# EAGLE design 6WLS-PASSIVE (EAGLE 7.4.0)
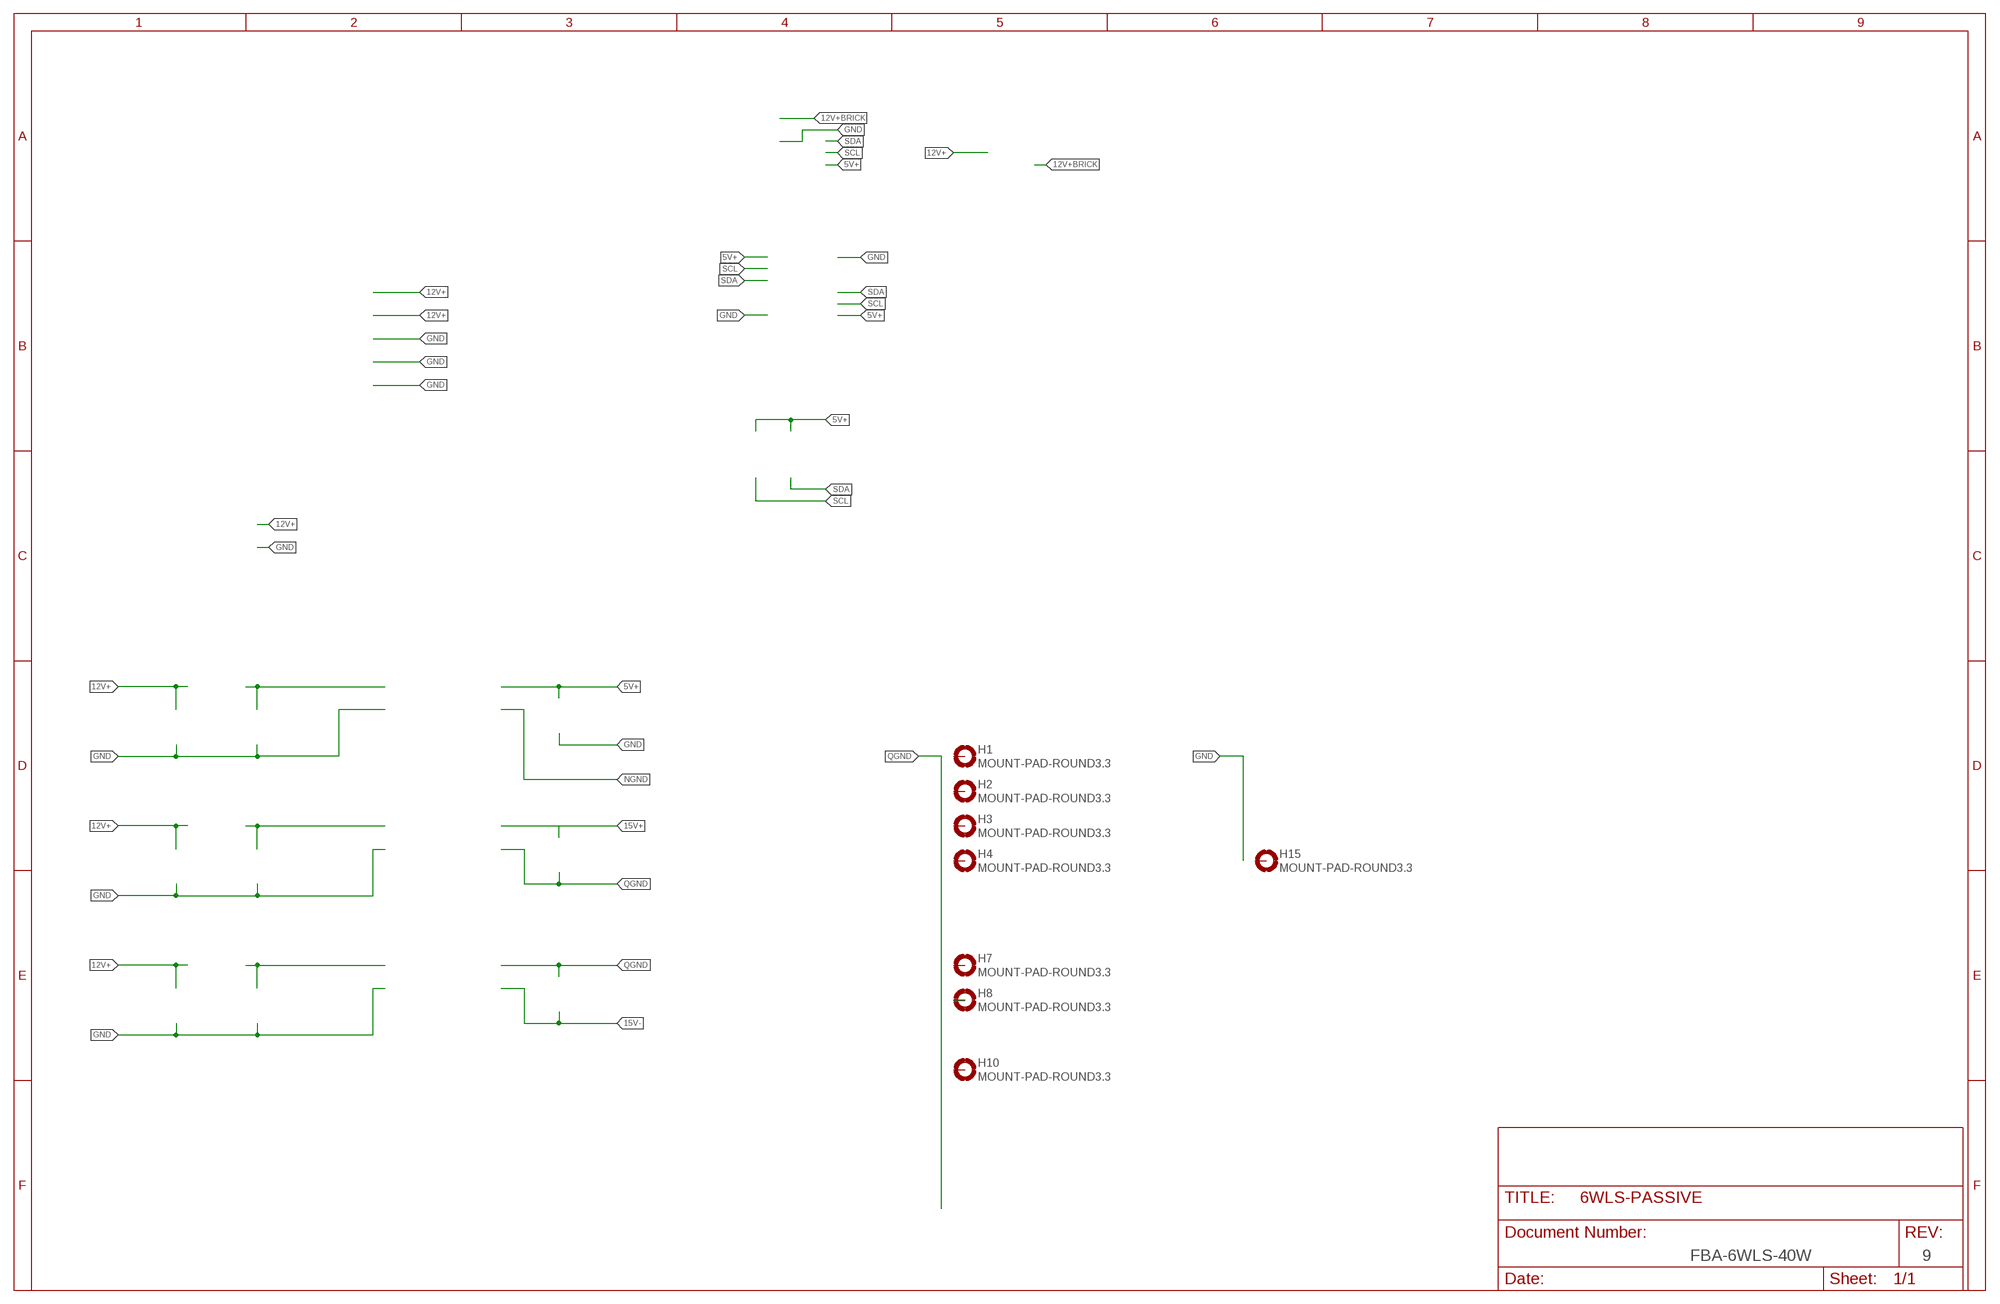
[diagram p0: schematic, sheet 1]

## Parts
H1  MOUNT-PAD-ROUND3.3  [3,3-PAD]
H2  MOUNT-PAD-ROUND3.3  [3,3-PAD]
H3  MOUNT-PAD-ROUND3.3  [3,3-PAD]
H4  MOUNT-PAD-ROUND3.3  [3,3-PAD]
H7  MOUNT-PAD-ROUND3.3  [3,3-PAD]
H8  MOUNT-PAD-ROUND3.3  [3,3-PAD]
H10  MOUNT-PAD-ROUND3.3  [3,3-PAD]
H15  MOUNT-PAD-ROUND3.3  [3,3-PAD]

## Nets
N$5: H8.B3,3(MOUNT)
Unconnected: H1.B3,3(MOUNT) H2.B3,3(MOUNT) H3.B3,3(MOUNT) H4.B3,3(MOUNT) H7.B3,3(MOUNT) H10.B3,3(MOUNT) H15.B3,3(MOUNT)

## Notes on the sheet
- FBA-6WLS-40W | 9

## Library data of the parts
H1-H4 H7 H8 H10 H15 = holes:MOUNT-PAD-ROUND: MOUNTING PAD, round

## Net classes
0 Signal: width 0.254 mm, clearance 0.205 mm
1 Power: width 0.508 mm, clearance 0.205 mm to class 0, clearance 0.205 mm
2 GND: width 0.889 mm

## Board
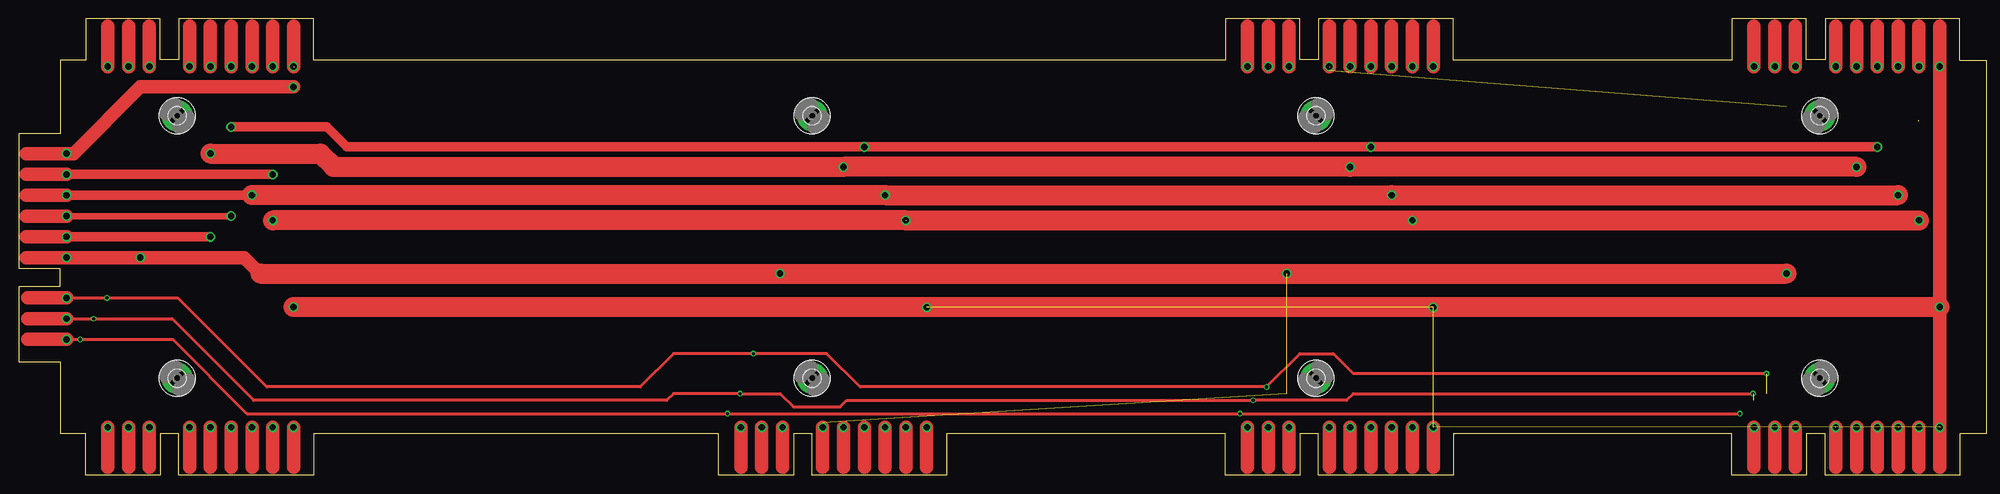
[diagram p1: board, top side]
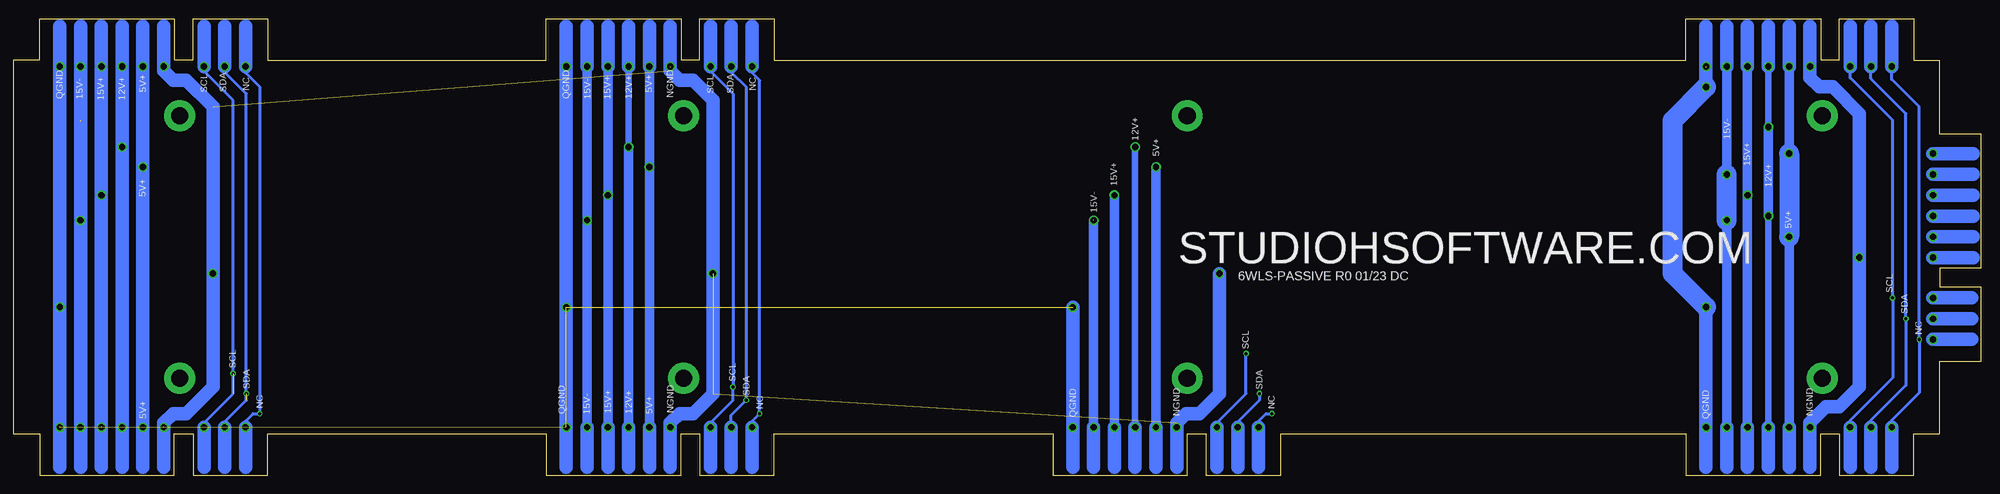
[diagram p2: board, bottom side, seen from below]

Size 374.97 x 87 mm. Coordinates in mm from the lower left corner, seen from the top.
Outline: 56.2,7.94 56.2,0 30.54,0 30.54,7.87 26.99,7.87 26.99,0 12.76,0 12.76,7.94 7.94,7.94 7.94,21.65 0,21.65 0,35.88 7.87,35.88 7.87,39.43 0,39.43 0,65.09 7.94,65.09 7.94,79.06 12.76,79.06 12.76,87 26.99,87 26.99,79.12 30.54,79.12 30.54,87 56.2,87 56.2,79.06 229.93,79.06 229.93,87 244.16,87 244.16,79.12 247.71,79.12 247.71,87 273.37,87 273.37,79.06 326.45,79.06 326.45,87 340.68,87 340.68,79.12 344.23,79.12 344.23,87 369.89,87 369.89,79.06 374.97,79.06 374.97,7.94 369.89,7.94 369.89,0 344.23,0 344.23,7.87 340.68,7.87 340.68,0 326.45,0 326.45,7.94 273.37,7.94 273.37,0 247.71,0 247.71,7.87 244.16,7.87 244.16,0 229.93,0 229.93,7.94 176.85,7.94 176.85,0 151.19,0 151.19,7.87 147.64,7.87 147.64,0 133.41,0 133.41,7.94 56.2,7.94
Copper layers (1*16): Top 0.035mm / dielectric 0.2mm / Bottom 0.035mm
Design rules "default *": minimum track width 10mil, minimum drill 20mil, track to track 8mil, track to pad 8mil, pad to pad 8mil, via to via 8mil, smd to smd 8mil, copper to edge 40mil, drill to drill 8mil, minimum pad ring 10mil, minimum via ring 8mil, stop-mask expansion 4mil, vias tented up to drill 0mil, thermal gap 10mil

### Footprints (pad centres in the part's own frame; a part is rotated, then mirrored left to right if it is on the bottom)
3,3-PAD = drill 3.3 pad 5.842: B3,3 0,0

### Placement (x,y rotation side)
H1  151.22,68.5 270 top
H2  151.22,18.5 270 top
H3  30.22,68.5 270 top
H4  30.22,18.5 270 top
H7  247.22,68.5 0 top
H8  247.22,18.5 0 top
H10  343.22,18.5 0 top
H15  343.22,68.5 0 top

### Tracks (layer width: path | path; a pad name or v marks a point on that pad's centre or on a via)
5V+  (via drill 1.2)
  Top 1.778: v9.14,45.43 v36.54,45.43
  Top 2.54: v36.54,9.14 36.54,1.52 | v36.54,77.85 36.54,85.5 | v9.14,45.43 1.49,45.43 | v157.19,9.14 157.19,1.52 | v253.71,9.14 253.71,1.52 | v253.71,77.85 253.71,85.5 | v350.23,9.14 350.23,1.52 | v350.23,77.85 350.23,85.5
  Top 3.81: v36.54,61.28 57.47,61.28 60.01,58.74 v157.19,58.74 v253.71,58.74 v350.23,58.74
  Bottom 1.27: 36.54,38.42 v36.54,45.43
  Bottom 1.778: v36.54,9.14 v36.54,45.43 | v36.54,77.85 v36.54,61.28 | v157.19,9.14 v157.19,58.74 | v253.71,77.85 v253.71,58.74 v253.71,9.14
  Bottom 2.54: v36.54,9.14 36.54,1.52 | v36.54,77.85 36.54,85.5 | v9.14,45.43 1.49,45.43 | v157.19,9.14 157.19,1.52 | v253.71,9.14 253.71,1.52 | v253.71,77.85 253.71,85.5 | 350.23,1.52 v350.23,9.14 v350.23,58.74 v350.23,77.85 350.23,85.5
  Bottom 3.81: v36.54,61.28 v36.54,45.43
12V+  (via drill 1.2)
  Top 1.27: v9.14,49.39 v40.5,49.39
  Top 1.778: v354.19,62.55 v257.67,62.55 v161.15,62.55 62.55,62.55 58.74,66.36 v40.5,66.36
  Top 2.54: v40.5,9.14 40.5,1.52 | v40.5,77.85 40.5,85.5 | v9.14,49.39 1.49,49.39 | v257.67,9.14 257.67,1.52 | v257.67,77.85 257.67,85.5 | v354.19,9.14 354.19,1.52 | v354.19,77.85 354.19,85.5 | v161.15,9.14 161.15,1.52
  Bottom 1.27: v40.5,9.14 v40.5,49.39 | v40.5,77.85 v40.5,66.36 | v257.67,77.85 v257.67,62.55 | v161.15,9.14 v161.15,62.55
  Bottom 1.778: v40.5,49.39 v40.5,66.36 | v257.67,9.14 v257.67,62.55
  Bottom 2.54: v40.5,9.14 40.5,1.52 | v40.5,77.85 40.5,85.5 | v9.14,49.39 1.49,49.39 | v257.67,9.14 257.67,1.52 | v257.67,77.85 257.67,85.5 | 354.19,1.52 v354.19,9.14 v354.19,62.55 v354.19,77.85 354.19,85.5 | v161.15,9.14 161.15,1.52
15V+  (via drill 1.2)  (1 unrouted)
  Top 1.778: v9.14,53.35 v44.46,53.35
  Top 2.54: v44.46,9.14 44.46,1.52 | v44.46,77.85 44.46,85.5 | v9.14,53.35 1.49,53.35 | v165.11,9.14 165.11,1.52 | v261.63,9.14 261.63,1.52 | v261.63,77.85 261.63,85.5 | v358.15,9.14 358.15,1.52 | v358.15,77.85 358.15,85.5
  Top 3.81: v44.46,53.35 v165.11,53.35 v261.63,53.35 v358.15,53.35
  Bottom 1.778: v44.46,9.14 v44.46,53.35 v44.46,77.85 | v165.11,9.14 v165.11,53.35 | v261.63,9.14 v261.63,53.35 v261.63,77.85
  Bottom 2.54: v44.46,9.14 44.46,1.52 | v44.46,77.85 44.46,85.5 | v9.14,53.35 1.49,53.35 | v165.11,9.14 165.11,1.52 | v261.63,9.14 261.63,1.52 | v261.63,77.85 261.63,85.5 | v358.15,9.14 358.15,1.52 | 358.15,85.5 v358.15,77.85 v358.15,53.35 358.15,9.27
15V-  (via drill 1.2)  (2 unrouted)
  Top 1.778: v9.14,57.32 v48.43,57.32
  Top 2.54: v48.43,9.14 48.43,1.52 | v48.43,77.85 48.43,85.5 | v9.14,57.32 1.49,57.32 | v169.08,9.14 169.08,1.52 | v265.6,9.14 265.6,1.52 | v265.6,77.85 265.6,85.5 | v362.12,9.14 362.12,1.52 | v362.12,77.85 362.12,85.5
  Top 3.81: v169.08,48.58 v48.43,48.58 | 169.23,48.58 v265.6,48.58 v362.12,48.58
  Bottom 1.778: v48.43,9.14 v48.43,48.58 | v48.43,77.85 v48.43,57.32 | v169.08,9.14 v169.08,48.58 | v265.6,9.14 v265.6,48.58 v265.6,77.85
  Bottom 2.54: v48.43,9.14 48.43,1.52 | v48.43,77.85 48.43,85.5 | v9.14,57.32 1.49,57.32 | v169.08,9.14 169.08,1.52 | v265.6,9.14 265.6,1.52 | v265.6,77.85 265.6,85.5 | 362.12,1.52 v362.12,9.14 v362.12,48.58 362.12,67.48 | 362.12,85.5 v362.12,77.85 362.12,67.63
  Bottom 3.81: v48.43,48.58 v48.43,57.32
NC  (via drill 0.6, 1.2)  (1 unrouted)
  Top 0.61: v9.14,25.87 v11.75,25.87 29.38,25.87 43.5,11.75 v135.09,11.75 v232.73,11.75 v327.98,11.75
  Top 2.54: v16.98,9.14 16.98,1.52 | v16.98,77.85 16.98,85.5 | v9.14,25.87 1.75,25.87 | v137.63,9.14 137.63,1.52 | v234.15,9.14 234.15,1.52 | v234.15,77.85 234.15,85.5 | v330.67,9.14 330.67,1.52 | v330.67,77.85 330.67,85.5
  Bottom 0.61: v16.98,9.14 16.98,10.48 11.75,15.71 v11.75,25.87 11.75,70.17 16.98,75.4 v16.98,77.85 | v137.63,9.14 137.63,10.33 136.21,11.75 v135.09,11.75 | v234.15,9.14 234.15,10.33 v232.73,11.75 232.73,75.25 234.15,76.67 234.15,77.79 | v330.67,9.14 330.67,10.33 329.25,11.75 v327.98,11.75 327.98,73.98 330.67,76.67 v330.67,77.85
  Bottom 2.54: v16.98,9.14 16.98,1.52 | v16.98,77.85 16.98,85.5 | v9.14,25.87 1.75,25.87 | v137.63,9.14 137.63,1.52 | v234.15,9.14 234.15,1.52 | v234.15,77.85 234.15,85.5 | v330.67,9.14 330.67,1.52 | v330.67,77.85 330.67,85.5
NGND  (via drill 1.2)  (6 unrouted)
  Top 2.54: v32.58,9.14 32.58,1.52 | v32.58,77.85 32.58,85.5 | 1.49,41.47 v9.14,41.47 v23.18,41.47 42.99,41.47 46.04,38.42 | v153.23,9.14 153.23,1.52 | v346.27,9.14 346.27,1.52 | v346.27,77.85 346.27,85.5 | v249.75,9.14 249.75,1.52 | v249.75,77.85 249.75,85.5
  Top 3.81: 46.04,38.42 v336.87,38.42
  Bottom 2.54: 32.58,1.52 v32.58,9.14 32.58,9.97 29.53,13.02 26.99,13.02 23.18,16.83 v23.18,41.47 23.18,68.9 28.26,73.98 30.8,73.98 32.58,75.76 v32.58,77.85 32.58,85.5 | v9.14,41.47 1.49,41.47 | 153.23,1.52 v153.23,9.14 153.23,9.97 151.45,11.75 148.91,11.75 145.1,15.56 145.1,38.35 | v346.27,9.14 346.27,1.52 | 346.27,85.5 v346.27,77.85 346.27,77.03 344.49,75.25 341.95,75.25 336.87,70.17 v336.87,38.42 336.87,16.83 341.95,11.75 344.49,11.75 346.27,9.97 346.27,9.27 | 249.75,1.52 v249.75,9.14 249.75,9.97 247.97,11.75 245.43,11.75 241.62,15.56 241.62,71.44 245.43,75.25 247.97,75.25 249.75,77.03 249.75,77.72 | v249.75,77.85 249.75,85.5
  other vias: 145.1,38.42 241.62,38.42
QGND  (via drill 1.2)  (6 unrouted)
  Top 2.54: v52.39,9.14 52.39,1.52 | 52.39,85.5 v52.39,77.85 | 1.49,61.28 v9.14,61.28 10.48,61.28 23.18,73.98 v52.39,73.98 | v173.04,9.14 173.04,1.52 | v269.56,9.14 269.56,1.52 | 269.56,85.5 v269.56,77.85 | v366.08,9.14 366.08,1.52 | 366.08,85.5 v366.08,77.85 v366.08,32.07 366.08,9.27
  Top 3.81: v52.39,32.07 v366.08,32.07
  Bottom 2.54: 52.39,1.52 v52.39,9.14 v52.39,32.07 | v52.39,77.85 52.39,85.5 | v9.14,61.28 1.49,61.28 | 173.04,1.52 v173.04,9.14 v173.04,32 | 269.56,1.52 v269.56,9.14 | 269.56,85.5 v269.56,77.85 269.56,9.27 | 366.08,1.52 v366.08,9.14 | 366.08,85.5 v366.08,77.85 366.08,9.27 | v52.39,73.98 52.39,77.72
  Bottom 3.81: v52.39,32.07 58.74,38.42 58.74,67.63 v52.39,73.98
  other vias: 269.56,32
SCL  (via drill 0.6, 1.2)  (1 unrouted)
  Top 0.61: v333.06,19.37 254.32,19.37 250.51,23.18 244.16,23.18 v237.81,16.83 160.34,16.83 153.99,23.18 v140.02,23.18 124.78,23.18 118.43,16.83 47.31,16.83 30.34,33.79 v16.83,33.79 v9.14,33.79
  Top 2.54: v24.9,9.14 24.9,1.52 | v24.9,77.85 24.9,85.5 | v9.14,33.79 1.75,33.79 | v145.55,9.14 145.55,1.52 | v242.07,9.14 242.07,1.52 | v242.07,77.85 242.07,85.5 | v338.59,9.14 338.59,1.52 | v338.59,77.85 338.59,85.5
  Bottom 0.61: v338.59,9.14 338.59,10.02 333.06,15.56 333.06,71.44 338.59,76.97 v338.59,77.85 | v24.9,9.14 24.9,10.48 16.83,18.55 v16.83,33.79 16.83,67.63 24.9,75.7 v24.9,77.85 | v242.07,9.14 242.07,10.02 237.81,14.29 v237.81,16.83 237.81,72.71 242.07,76.97 v242.07,77.85 | v145.55,9.14 145.55,10.02 140.02,15.56 v140.02,23.18
  Bottom 2.54: v24.9,9.14 24.9,1.52 | v24.9,77.85 24.9,85.5 | v9.14,33.79 1.75,33.79 | v145.55,9.14 145.55,1.52 | v242.07,9.14 242.07,1.52 | v242.07,77.85 242.07,85.5 | v338.59,9.14 338.59,1.52 | v338.59,77.85 338.59,85.5
SDA  (via drill 0.6, 1.2)  (1 unrouted)
  Top 0.61: v9.14,29.83 v14.29,29.83 29.22,29.83 44.77,14.29 123.51,14.29 124.78,15.56 v137.48,15.56 145.1,15.56 147.64,13.02 156.53,13.02 157.8,14.29 v235.27,14.29 253.05,14.29 254.32,15.56 v330.52,15.56
  Top 2.54: v20.94,9.14 20.94,1.52 | v20.94,77.85 20.94,85.5 | v9.14,29.83 1.75,29.83 | v141.59,9.14 141.59,1.52 | v238.11,9.14 238.11,1.52 | v238.11,77.85 238.11,85.5 | v334.63,9.14 334.63,1.52 | v334.63,77.85 334.63,85.5
  Bottom 0.61: v137.48,15.56 137.48,14.29 141.59,10.17 v141.59,9.14 | v20.94,9.14 20.94,10.48 14.29,17.13 v14.29,29.83 14.29,68.9 20.94,75.55 v20.94,77.85 | v334.63,9.14 334.63,10.17 330.52,14.29 330.52,72.71 334.63,76.82 v334.63,77.85 | v238.11,77.85 238.11,76.82 235.27,73.98 v235.27,14.29 238.11,11.44 v238.11,9.14
  Bottom 2.54: v20.94,9.14 20.94,1.52 | v20.94,77.85 20.94,85.5 | v9.14,29.83 1.75,29.83 | v141.59,9.14 141.59,1.52 | v238.11,9.14 238.11,1.52 | v238.11,77.85 238.11,85.5 | v334.63,9.14 334.63,1.52 | v334.63,77.85 334.63,85.5

### Text on the board
bNames: NC | SDA | SCL | 5V+ | NC | SDA | SCL | 5V+ | NGND | 12V+ | 15V+ | 15V- | QGND | 12V+ | 15V+ | 15V- | QGND | 15V- | 12V+ | 5V+ | 15V+ | 12V+ | 15V+ | 5V+ | 15V- | 5V+ | STUDIOHSOFTWARE.COM | 6WLS-PASSIVE R0 01/23 DC | SCL | SDA | NC | SCL | SCL | SCL | SDA | SDA | SDA | NC | NC | NC | NGND | 5V+ | 12V+ | 15V+ | 15V- | QGND | NGND | QGND | NGND | QGND | 5V+